# EAGLE design roomba_wall_v2 (EAGLE 7.5.0)
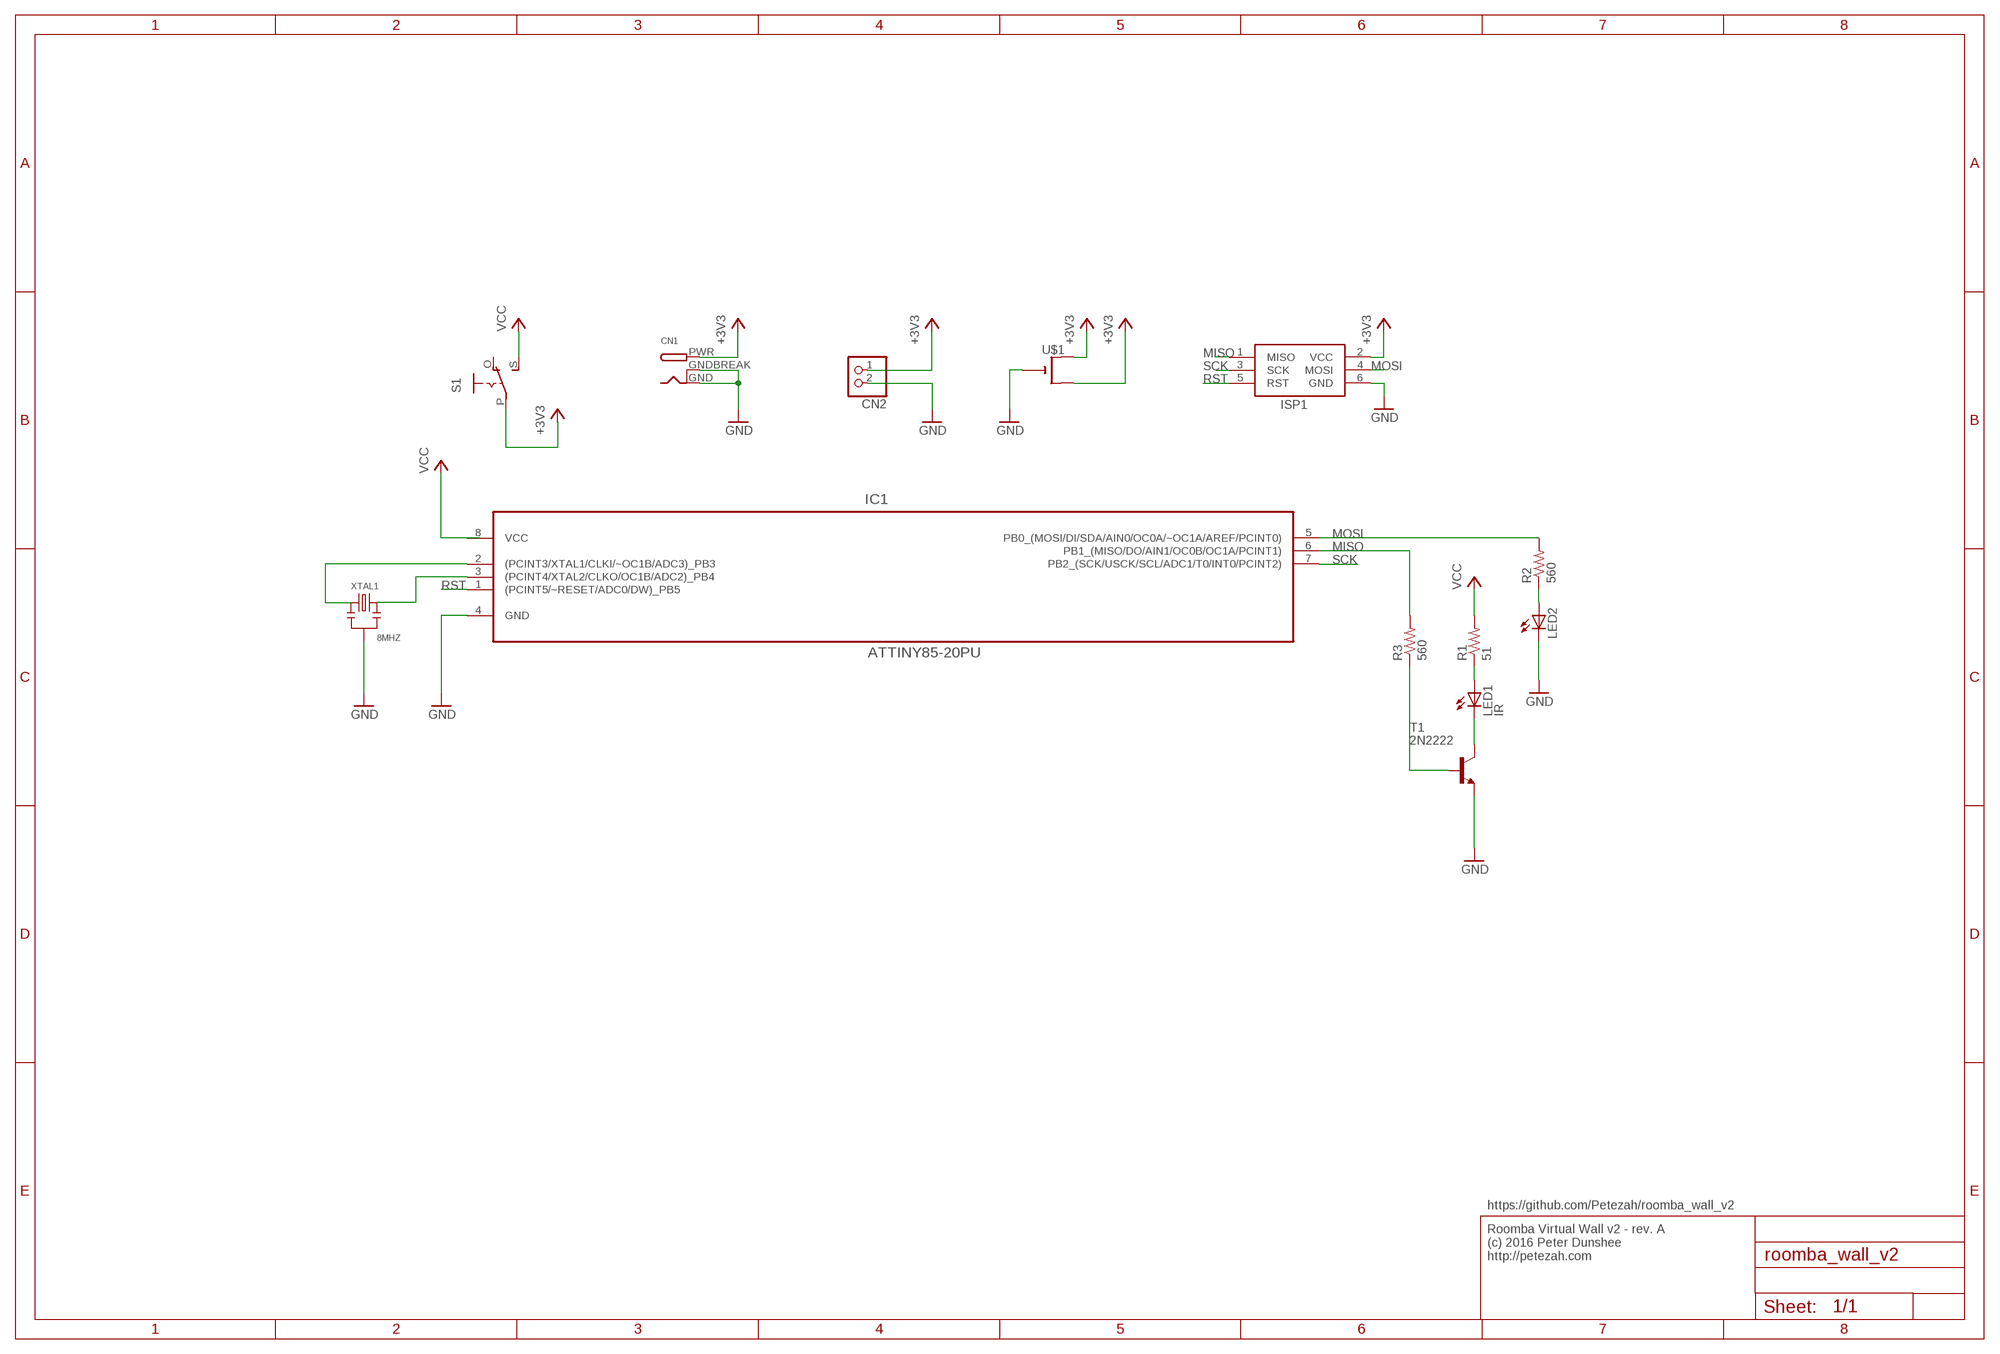
[diagram p0: schematic, sheet 1]

## Parts
CN1  DCBARRELPTH  [DCJACK_2MM_PTH]
CN2  JST_2PIN-SMT-RA  [JST-PH-2-SMT-RA]
IC1  ATTINY85-20PU  [DIP254P762X533-8]
ISP1  AVRISP-6  [AVRISP]
LED1  IR  LED3MM  [LED3MM]
LED2  LED3MM  [LED3MM]
R1  51  R-US_0204/7  [0204/7]
R2  560  R-US_0204/7  [0204/7]
R3  560  R-US_0204/7  [0204/7]
S1  EG1218S  [EG1218]
T1  2N2222  [TO92-EBC-OVAL]
U$1  CR2032THM  [CR2032-THRU]
XTAL1  8MHZ  DIP-CERAMIC-RESONATOR/-OSCILLATOR-8MHZ(3P-2.5-8X3MM)  [X3-2.5-8X3X5.5MM]

## Nets
+3V3: CN1.PWR CN2.1 ISP1.2(VCC) S1.P U$1.+1(+) U$1.+2(+1)
GND: CN1.GND CN1.GNDBREAK CN2.2 IC1.4(GND) ISP1.6(GND) LED2.K(C) T1.E U$1.- XTAL1.2
MISO: IC1.6(PB1_(MISO/DO/AIN1/OC0B/OC1A/PCINT1)) ISP1.1(MISO) R3.2
MOSI: IC1.5(PB0_(MOSI/DI/SDA/AIN0/OC0A/~OC1A/AREF/PCINT0)) ISP1.4(MOSI) R2.2
N$1: IC1.2((PCINT3/XTAL1/CLKI/~OC1B/ADC3)_PB3) XTAL1.1
N$2: IC1.3((PCINT4/XTAL2/CLKO/OC1B/ADC2)_PB4) XTAL1.3
N$3: LED1.A R1.1
N$4: LED1.K(C) T1.C
N$5: R3.1 T1.B
N$6: LED2.A R2.1
RST: IC1.1((PCINT5/~RESET/ADC0/DW)_PB5) ISP1.5(RST)
SCK: IC1.7(PB2_(SCK/USCK/SCL/ADC1/T0/INT0/PCINT2)) ISP1.3(SCK)
VCC: R1.2 S1.S
Unconnected: S1.O

## Notes on the sheet
- https://github.com/Petezah/roomba_wall_v2
- Roomba Virtual Wall v2 - rev. A
  (c) 2016 Peter Dunshee
  http://petezah.com

## Power pins joined to a net without a drawn wire
VCC: IC1.8(VCC)

## Library data of the parts
CN1 = adafruit:DCBARREL: 2.0mm DC Barrel Jack DCJACK_2MM_PTH - Through Hole Jack (4UConnector: 05537)
CN2 = adafruit:JST_2PIN: JST 2-Pin Connectors of various flavors SMT-RA (S2B-PH-SM4) 4UConnector #17311 SMT (B2B-PH-SM4) THM-RA (S2B-PH) THM (B2B-PH)
IC1 = Atmel_By_element14_Batch_1-00:ATTINY85-20PU: 8-bit Microcontroller with In-System Programmable Flash; MPN: ATTINY85-20PU; OC_FARNELL: 1455162; OC_NEWARK: 58M3796; PACKAGE: PDIP-8; SUPPLIER: Atmel
ISP1 = adafruit:AVRISP: AVR ISP HEADER Standard 6 pin header for AVR programming
LED1 LED2 = adafruit:LED: LED OSRAM: - CHIPLED LG R971, LG N971, LY N971, LG Q971, LY Q971, LO R971, LY R971 LH N974, LH R974 LS Q976, LO Q976, LY Q976 LO Q996 - Hyper CHIPLED LW Q18S LB Q993, LB Q99A, LB R99A - SideLED LS A670, LO A670, LY A670, LG A670, LP A670 LB A673, LV A673, LT A673, LW A673 LH A674 LY A675 LS A676, LA A676, LO A676, LY A676, LW A676 LS A679, LY A679, LG A679 - Hyper Micro SIDELED® LS Y876, LA Y876, LO Y876, LY Y876 LT Y87S - SmartLED LW L88C, LW L88S LB L89C, LB L89S, LG L890 LS L89K, LO L89K, LY L89K LS L896, LA L896, LO L896, LY L896 - TOPLED LS T670, LO T670, LY T670, LG T670, LP T670 LSG T670, LSP T670, LSY T670, LOP T670, LYG T670 LG T671, LOG T671, LSG T671 LB T673, LV T673, LT T673, LW T673 LH T674 LS T676, LA T676, LO T676, LY T676, LB T676, LH T676, LSB T676, LW T676 LB T67C, LV T67C, LT T67C, LS T67K, LO T67K, LY T67K, LW E67C LS E67B, LA E67B, LO E67B, LY E67B, LB E67C, LV E67C, LT E67C LW T67C LS T679, LY T679, LG T679 LS T770, LO T770, LY T770, LG T770, LP T770 LB T773, LV T773, LT T773, LW T773 LH T774 LS E675, LA E675, LY E675, LS T675 LS T776, LA T776, LO T776, LY T776, LB T776 LHGB T686 LT T68C, LB T68C - Hyper Mini TOPLED® LB M676 - Mini TOPLED Santana® LG M470 LS M47K, LO M47K, LY M47K Source: http://www.osram.convergy.de/
R1-R3 = adafruit:R-US_: RESISTOR, American symbol
S1 = adafruit:EG1218: SLIDING SWITCH 0.1" spacing through hole, vertical SPDT slide switch http://www.ladyada.net/library/pcb/eaglelibrary.html
T1 = adafruit:2N2222: NPN TRANSISTOR Big oval pads
U$1 = adafruit:CR2032
XTAL1 = Seeed-OPL-Crystal-Oscillator:DIP-CERAMIC-RESONATOR/-OSCILLATOR-8MHZ(3P-2.5-8X3MM): 306030010; MPN: CSTLS8M00G53Z-A0

## Board
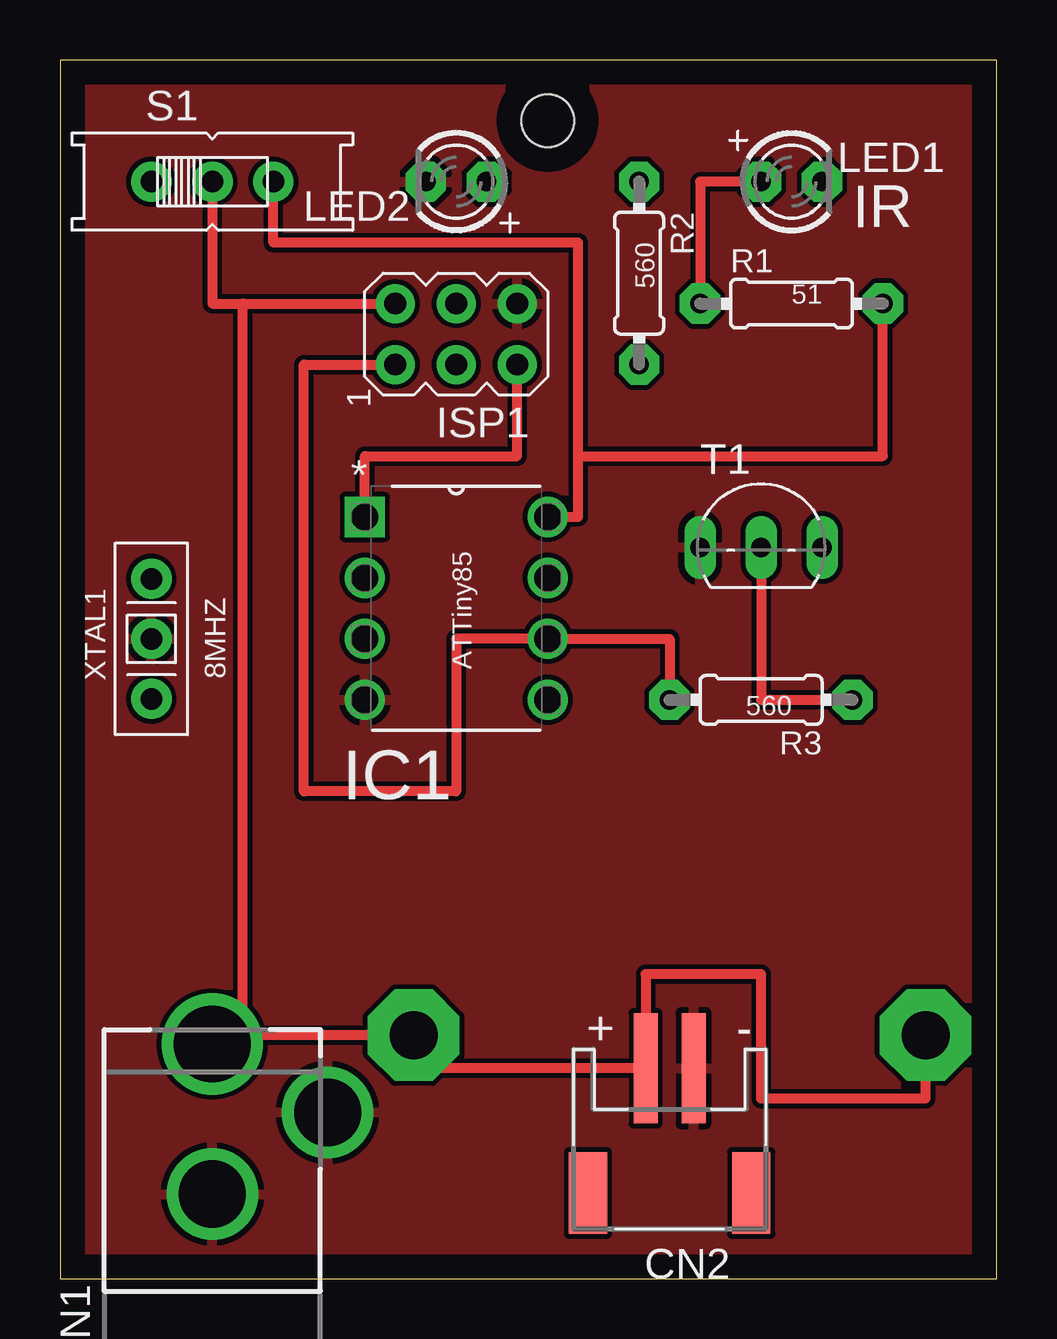
[diagram p1: board, top side]
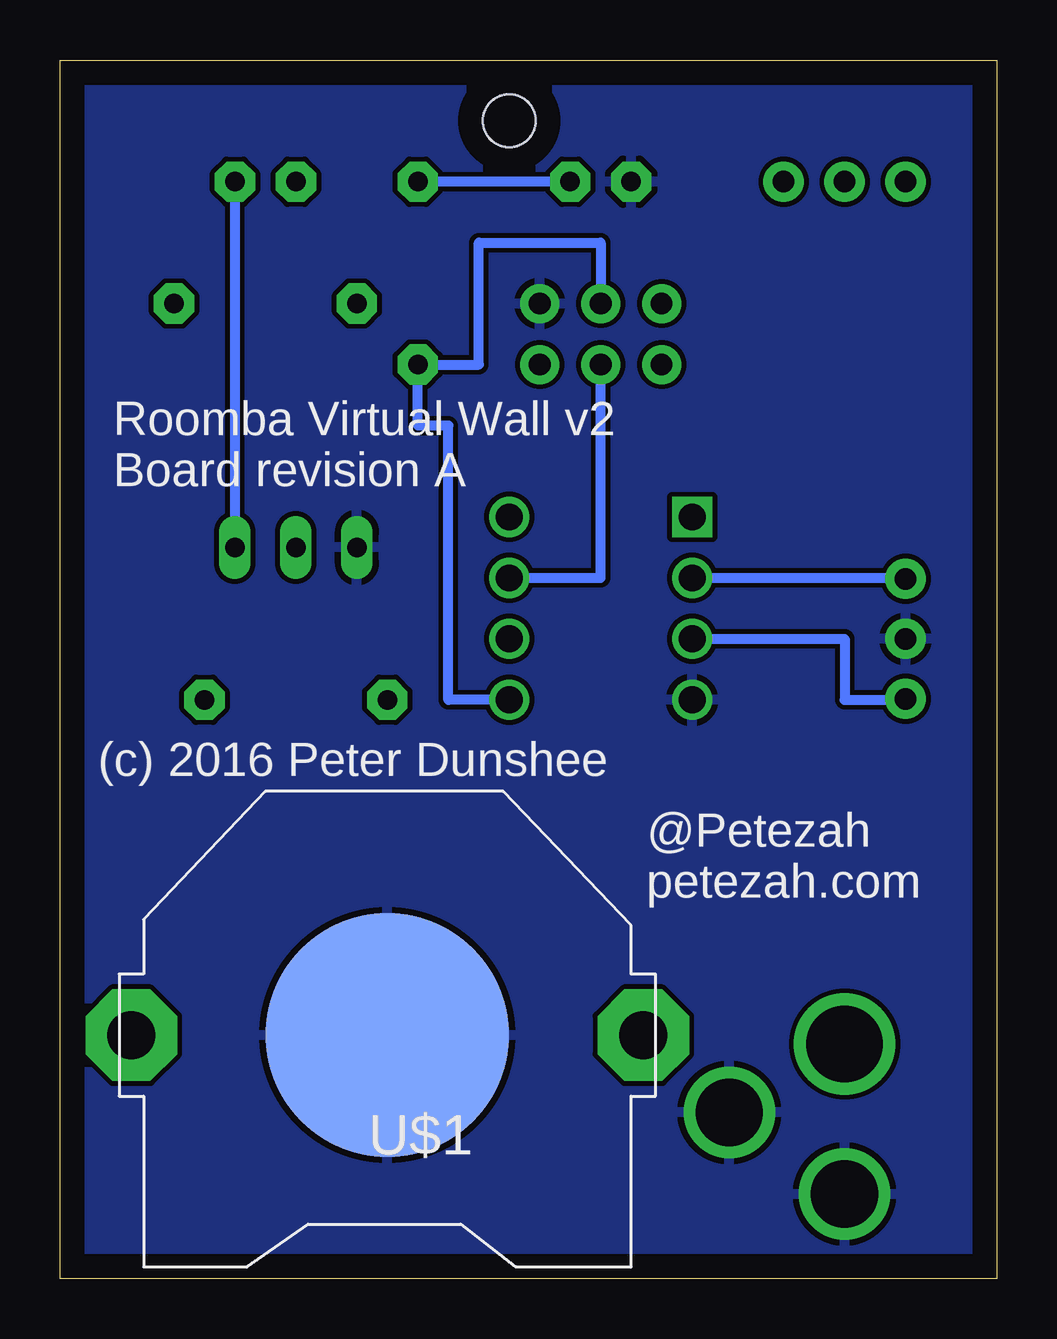
[diagram p2: board, bottom side, seen from below]

Size 39.04 x 50.79 mm. Coordinates in mm from the lower left corner, seen from the top.
Outline: 0,0 39.04,0 39.04,50.79 0,50.79 0,0
Copper layers (1*16): Top 0.035mm / dielectric 1.5mm / Bottom 0.035mm
Design rules "default": minimum track width 10mil, minimum drill 24mil, track to track 8mil, track to pad 8mil, pad to pad 8mil, via to via 8mil, smd to smd 8mil, copper to edge 40mil, drill to drill 8mil, minimum pad ring 10mil, minimum via ring 8mil, stop-mask expansion 4mil, vias tented up to drill 0mil, thermal gap 10mil
Holes 2.2 mm at 20.32,48.26

### Footprints (pad centres in the part's own frame; a part is rotated, then mirrored left to right if it is on the bottom)
DCJACK_2MM_PTH = drill 2.8: GND 0,7.35; GNDBREAK 4.8,10.75 | drill 3.2: PWR 0,13.6
JST-PH-2-SMT-RA = smd 1 x 4.6: 1 1,-3.7; 2 -1,-3.7 | smd 1.6 x 3.4: NC1 -3.4,1.5; NC2 3.4,1.5
DIP254P762X533-8 = drill 1.118 square: 1 -7.62,7.62 | drill 1.118: 2 -7.62,5.08; 3 -7.62,2.54; 4 -7.62,0; 5 0,0; 6 0,2.54; 7 0,5.08; 8 0,7.62
AVRISP = drill 0.9 pad 1.626: 1 -1.27,2.54; 2 1.27,2.54; 3 -1.27,0; 4 1.27,0; 5 -1.27,-2.54; 6 1.27,-2.54
LED3MM = drill 0.813 pad 1.676 octagon: A -1.27,0; K 1.27,0
0204/7 = drill 0.813 pad 1.676 octagon: 1 -3.81,0; 2 3.81,0
EG1218 = drill 0.9 pad 1.676: O -2.54,0; P 0,0; S 2.54,0
TO92-EBC-OVAL = drill 0.813 long: B 0,-1.27; C 2.54,-1.27; E -2.54,-1.27
CR2032-THRU = drill 2 pad 3.81 octagon: +1 -10.668,0; +2 10.668,0 | smd 10.16 x 10.16: - 0,0
X3-2.5-8X3X5.5MM = drill 0.9 pad 1.676: 1 2.5,0; 2 0,0; 3 -2.5,0

### Placement (x,y rotation side)
CN1  6.35,-3.81 0 top
CN2  25.4,5.08 180 top
IC1  20.32,24.13 0 top
ISP1  16.51,39.37 90 top
LED1  30.48,45.72 0 top
LED2  16.51,45.72 180 top
R1  30.48,40.64 0 top
R2  24.13,41.91 270 top
R3  29.21,24.13 180 top
S1  6.35,45.72 0 top
T1  29.21,31.75 0 top
U$1  25.4,10.16 180 bottom
XTAL1  3.81,26.67 90 top

### Tracks (layer width: path | path; a pad name or v marks a point on that pad's centre or on a via)
+3V3
  Top 0.406: U$1.+2 36.07,7.51 29.21,7.51 29.21,12.7 24.4,12.7 CN2.1 14.73,8.78 U$1.+1 7.62,10.16 | 7.62,10.16 6.35,10.16 CN1.PWR | 7.62,10.16 7.62,40.64 | S1.P 6.35,40.64 7.62,40.64 | 7.62,40.64 ISP1.2
GND
  pour Bottom: 0,50.8 39.37,50.8 39.37,0 0,0
  pour Top: 0,50.8 39.37,50.8 39.37,0 0,0
MISO
  Top 0.406: R3.2 25.4,26.67 IC1.6 16.51,26.67 16.51,20.32 10.16,20.32 10.16,38.1 ISP1.1
MOSI
  Bottom 0.406: IC1.5 22.86,24.13 22.86,35.56 24.13,35.56 R2.2 21.59,38.1 21.59,43.18 16.51,43.18 ISP1.4
N$1
  Bottom 0.406: IC1.2 3.81,29.21 XTAL1.1
N$2
  Bottom 0.406: IC1.3 6.35,26.67 6.35,24.13 3.81,24.13 XTAL1.3
N$3
  Top 0.406: LED1.A 26.67,45.72 R1.1
N$4
  Bottom 0.406: LED1.K T1.C
N$5
  Top 0.406: T1.B 29.21,24.13 R3.1
N$6
  Bottom 0.406: LED2.A R2.1
RST
  Top 0.406: IC1.1 12.7,34.29 19.05,34.29 ISP1.5
SCK
  Bottom 0.406: IC1.7 16.51,29.21 ISP1.3
VCC
  Top 0.406: R1.2 34.29,34.29 21.59,34.29 | IC1.8 21.59,31.75 21.59,34.29 | 21.59,34.29 21.59,43.18 8.89,43.18 S1.S

### Text on the board
tPlace: IR | 560 | 51 | ATTiny85 | 560
bPlace: Roomba Virtual Wall v2 / Board revision A | (c) 2016 Peter Dunshee | @Petezah / petezah.com